# Altium schematic sheet PCB1.SchDoc
size A; SheetNumber: 1; SheetTotal: 1
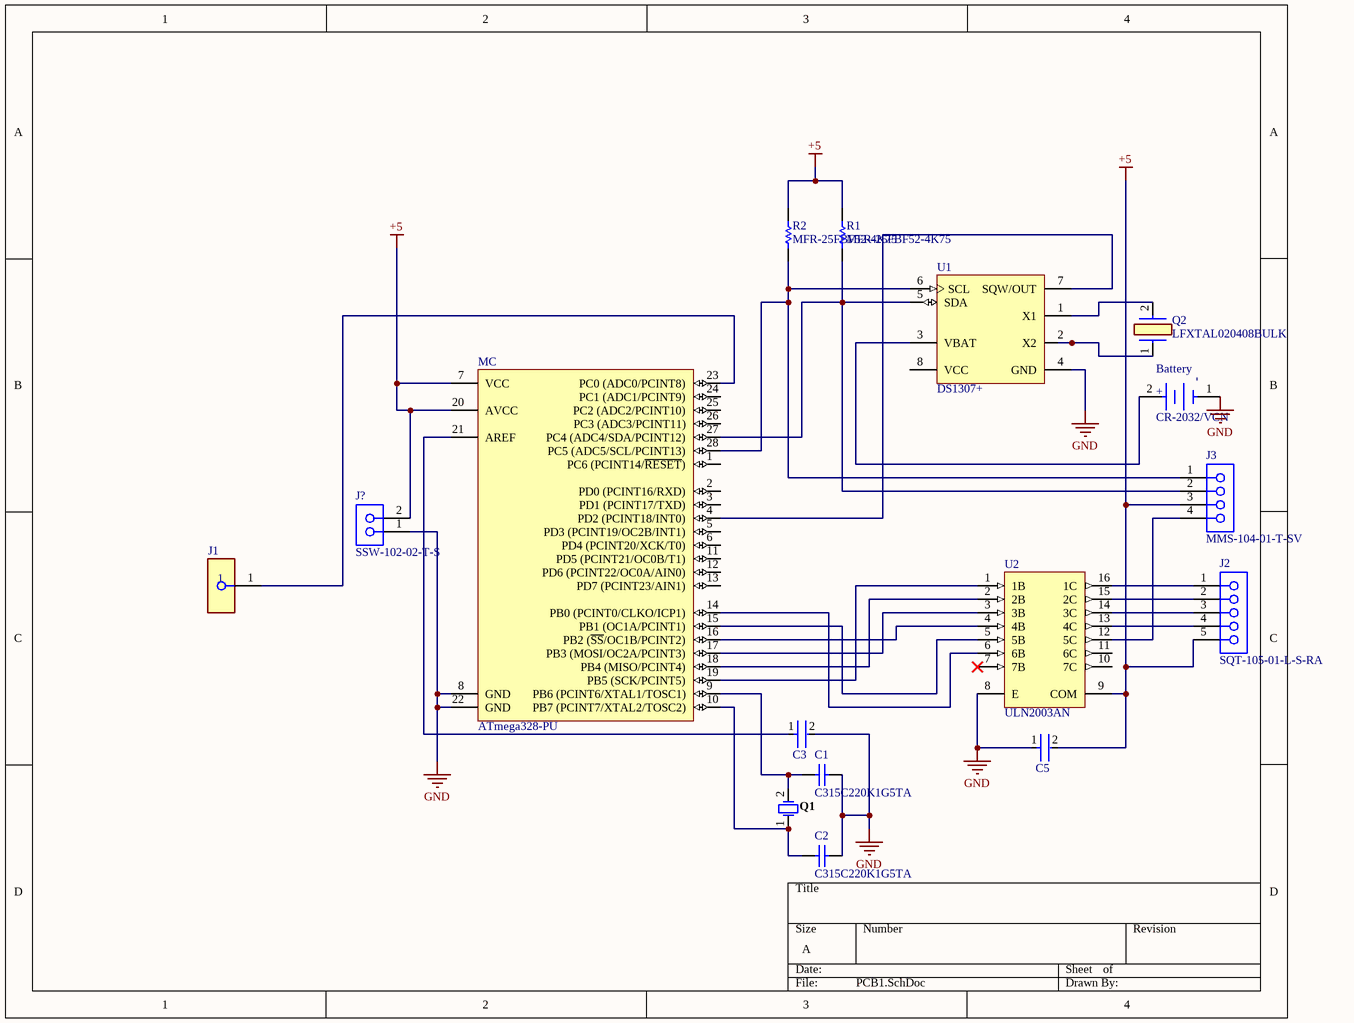
[diagram p0: PCB1.SchDoc]

## Parts
Battery  CR-2032/VCN  [FP-CR-2032-VCN-MFG]
C1  C315C220K1G5TA  [KEMT-C315-THT-2]
C2  C315C220K1G5TA  [KEMT-C315-THT-2]
C3  C322C104K5R5TA  [FP-C322C104K5R5TA-MFG]  (value not drawn)
C5  C322C104K5R5TA  [FP-C322C104K5R5TA-MFG]  (value not drawn)
J1  1801-0-15-15-30-27-04-0  [FP-1801-0-15-15-30-27-04-MFG]  (value not drawn)
J2  SQT-105-01-L-S-RA  [SMTC-SQT-105-01-X-S-RA]
J3  MMS-104-01-T-SV  [SMTC-MMS-104-01-X-SV]
J?  SSW-102-02-T-S  [SMTC-SSW-102-02-X-S]
MC  ATmega328-PU  [28P3]
Q1  FOXSLF/160-20  [FOX-FOXSLF160-20]  (value not drawn)
Q2  LFXTAL020408BULK  [LFXTAL020408BULK]
R1  MFR-25FBF52-4K75  [RESA60-630X240]
R2  MFR-25FBF52-4K75  [RESA60-630X240]
U1  DS1307+  [P8+2]
U2  ULN2003AN  [N0016A]

## Nets
+5: C5.2 J2.5 J3.3 J?.2 MC.7(VCC) MC.20(AVCC) R1.2 R2.2 U2.9(COM)
GND: Battery.1(C) C1.2 C2.2 C3.2 C5.1 J?.1 MC.8(GND) MC.22(GND) U1.4(GND) U2.8(E)
NetBattery_2: Battery.2(A) U1.3(VBAT)
NetC1_1: C1.1 MC.9(PB6_(PCINT6/XTAL1/TOSC1)) Q1.2
NetC2_1: C2.1 MC.10(PB7_(PCINT7/XTAL2/TOSC2)) Q1.1
NetC3_1: C3.1 MC.21(AREF)
NetJ1_1: J1.1 MC.23(PC0_(ADC0/PCINT8))
NetJ2_1: J2.1 U2.16(1C)
NetJ2_2: J2.2 U2.15(2C)
NetJ2_3: J2.3 U2.14(3C)
NetJ2_4: J2.4 U2.13(4C)
NetJ3_1: J3.1 MC.28(PC5_(ADC5/SCL/PCINT13)) R2.1 U1.6(SCL)
NetJ3_2: J3.2 MC.27(PC4_(ADC4/SDA/PCINT12)) R1.1 U1.5(SDA)
NetJ3_4: J3.4 U2.12(5C)
NetMC_4: MC.4(PD2_(PCINT18/INT0)) U1.7(SQW/OUT)
NetMC_14: MC.14(PB0_(PCINT0/CLKO/ICP1)) U2.6(6B)
NetMC_15: MC.15(PB1_(OC1A/PCINT1)) U2.5(5B)
NetMC_16: MC.16(PB2_(~{SS}/OC1B/PCINT2)) U2.4(4B)
NetMC_17: MC.17(PB3_(MOSI/OC2A/PCINT3)) U2.3(3B)
NetMC_18: MC.18(PB4_(MISO/PCINT4)) U2.2(2B)
NetMC_19: MC.19(PB5_(SCK/PCINT5)) U2.1(1B)
NetQ2_1: Q2.1 U1.2(X2)
NetQ2_2: Q2.2 U1.1(X1)

Not connected (* = marked no-connect by the designer): MC 1(PC6_(PCINT14/~{RESET})) 2(PD0_(PCINT16/RXD)) 3(PD1_(PCINT17/TXD)) 5(PD3_(PCINT19/OC2B/INT1)) 6(PD4_(PCINT20/XCK/T0)) 11(PD5_(PCINT21/OC0B/T1)) 12(PD6_(PCINT22/OC0A/AIN0)) 13(PD7_(PCINT23/AIN1)) 24(PC1_(ADC1/PCINT9)) 25(PC2_(ADC2/PCINT10)) 26(PC3_(ADC3/PCINT11)); U1 8(VCC); U2 7(7B)* 10(7C) 11(6C)

## Notes on the sheet
- (in symbol CMP-05417-000001-1) -; +

## Library data of the parts
Battery = CMP-05417-000001-1: BATTERY LITHIUM 3V COIN 20MM; Manufacturer: Panasonic; Standoff Height: 1mm; Device Class L3: unset; Octopart: https://octopart.com/cr-2032%2Fvcn-panasonic-19088802; Temperature: -30°C to +60°C; Temperature Range High: +60°C; Height: 22.3mm; ComponentLink2URL: https://media.digikey.com/pdf/Data%20Sheets/Panasonic%20Batteries%20PDFS/CR-2032_VCN_Dwg.PDF; Mouser Description: Coin Cell Battery 3V 225mAH; Category: Batt; Automotive: No; Device Class L1: Passive Components; Digikey Description: BATTERY LITHIUM 3V COIN 20MM; Device Class L2: unset; Manufacturer Part Number: CR-2032/VCN; ComponentLink2Description: Datasheet; Temperature Range Low: -30°C; Package: CR-2032/VCN
C1 C2 = CMP-1664-00008-1: Capacitor, Ceramic, 22 pF, +/-10 %, 100 V, -55 to 125 degC, 2-Pin THD, RoHS, Bulk; Max Input Voltage: 40 V; Min Input Voltage: 4.2 V; Output Current: 1.5 A; Output Voltage: 1.2 V; Outputs: 1; Case\Package: TO-220; RoHSCompliant: true; Min Operating Temperature: 0 degC; Max Operating Temperature: 125 degC; Package Quantity: 50; ComponentLink2URL: http://capacitoredge.kemet.com/capedge2/DataSheet/Datasheet-C315C220K1G5TA.pdf?pn=C315C220K1G5TA{BULK}; Radiation Hardening: No; Pins: 3; Length: 10.28 mm; ComponentLink1URL: http://www.kemet.com/; ComponentLink2Description: Datasheet; Height: 9.28 mm; REACH SVHC: No SVHC; ComponentLink1Description: Manufacturer URL; Max Ouput Current: 1.5 A; Weight: 0.08113 oz; Packaging: Rail/Tube; DatasheetVersion: Aug-16; Mount: Through Hole; PackageReference: C315-THT-2; Width: 4.82 mm; PackageDescription: 2-Pin Through Hole Device, Body 3.81 x 2.54 mm
C3 C5 = CMP-03020-034661-1: CAP CER 0.1UF 50V X7R RADIAL; Capacitance: 100nF; Dielectric Material: Ceramic; Dissipation Factor: 2.5%; Lead Length: 7mm; Tolerance: 10%; Lead Diameter: 0.51mm; Lead/Base Style: Formed Leads; Construction: RADIAL; RoHS Compliant: Yes; Voltage Rating (DC): 50V; Packaging: Bulk; Lead Free: Lead Free; Width: 0.125inch; Lead Pitch: 5.08mm; Voltage Rating: 50V; Number of Pins: 2; Radiation Hardening: No; Material: Ceramic; REACH SVHC: No SVHC; Height - Seated (Max): 0.26inch; Case/Package: Radial; Weight: 0.0625lb; Dielectric: X7R; Min Operating Temperature: -55°C; Voltage: 50V; Series: Golden Max™; Max Operating Temperature: 125°C; Height: 3.18mm; Termination: Radial; Length: 5.08mm; Depth: 3.18mm; Package Quantity: 500; Mount: Through Hole
J1 = CMP-07777-000001-1: CONN PIN RCPT .015-.025 PRESSFIT; Manufacturer: Mill-Max; Conn Orientation: Straight; Number Of Contacts: 1; Is Female: yes; Current Rating: 3A; Device Class L2: unset; Automotive: No; Temperature Range High: +125°C; Lead Free: Yes; Mouser Description: Circuit Board Hardware - PCB 10u AU OVER NI 30 CON; ComponentLink2URL: https://www.mill-max.com/products/datasheet/recpin/1801-0-15-15-30-27-04-0; Octopart: https://octopart.com/1801-0-15-15-30-27-04-0-mill-max-1175098; Device Class L1: Connectors; Manufacturer Part Number: 1801-0-15-15-30-27-04-0; Temperature Range Low: -55°C; Digikey Description: CONN PIN RCPT .015-.025 PRESSFIT; Package: 1801-0-15-15-30-27-04-0; ComponentLink2Description: Datasheet; Device Class L3: unset; RoHS: TRUE; Contact Material: Gold,Nickel; Category: Conn; Temperature: -55°C to +125°C; Height: 4.32mm
J2 = CMP-1021-00083-1: Cost-Effective Rugged Socket, Through-hole, Right Angle, -55 to 125 degC, 2 mm Pitch, 5-Pin, Female, RoHS; Manufacturer: Samtec; Pitch: 2 mm; ComponentLink3Description: Package Specification; PackageVersion: BY, 7/1995; PackageReference: SQT-105-01-X-S-RA; ComponentLink1URL: http://www.samtec.com; DatasheetVersion: F-214; Mounting Technology: Through-hole; PartNumber: SQT-105-01-L-S-RA; Temperature Range: -55 to 125 degC; Orientation: Right Angle; ComponentLink2Description: Datasheet; ComponentLink3URL: http://www.samtec.com/documents/webfiles/cpdf/SQT-1XX-XX-XXX-X-XXX-XXX-MKT.pdf; RoHS: True; ComponentLink1Description: Manufacturer URL; PackageDescription: 2mm Socket Strip Assembly; ComponentLink2URL: http://www.samtec.com/documents/webfiles/pdf/SQT_TH.PDF
J3 = CMP-1022-00068-1: Tiger Claw(TM) Socket Strip, Through-hole, Vertical, -55 to 105 degC, 2 mm Pitch, 4-Pin, Female, RoHS; Manufacturer: Samtec; Pitch: 2 mm; PackageDescription: 2mm Through Hole Box Connector Strip Assembly; DatasheetVersion: F-214; ComponentLink1URL: http://www.samtec.com; RoHS: True; Temperature Range: -55 to 105 degC; ComponentLink1Description: Manufacturer URL; PartNumber: MMS-104-01-T-SV; Mounting Technology: Through-hole; ComponentLink2Description: Datasheet; Orientation: Vertical; ComponentLink2URL: http://www.samtec.com/documents/webfiles/pdf/MMS.PDF; ComponentLink3Description: Package Specification; ComponentLink3URL: http://www.samtec.com/documents/webfiles/cpdf/MMS-1XX-01-XXX-XX-XXX-MKT1.pdf; PackageVersion: AO, 2/1993; PackageReference: MMS-104-01-X-SV
J? = CMP-1023-00323-1: SQ Post Socket, Through-hole, Vertical, -55 to 105 degC, 2.54 mm Pitch, 2-Pin, Female, RoHS; Manufacturer: Samtec; Pitch: 2.54 mm; ComponentLink3Description: Package Specification; ComponentLink2Description: Datasheet; ComponentLink1Description: Manufacturer URL; PackageVersion: CA, 6/1987; DatasheetVersion: F-214; PackageDescription: Assembly, Socket Strip .016 X .031 Tail; ComponentLink2URL: http://www.samtec.com/documents/webfiles/pdf/SSW_TH.PDF; RoHS: True; ComponentLink3URL: http://www.samtec.com/documents/webfiles/cpdf/SSW-1XX-XX-XXX-X-XX-XXX-XX-MKT.pdf; ComponentLink1URL: http://www.samtec.com; PackageReference: SSW-102-02-X-S; Mounting Technology: Through-hole; Orientation: Vertical; Temperature Range: -55 to 105 degC; PartNumber: SSW-102-02-T-S
MC = CMP-0095-00015-2: 8-bit AVR Microcontroller, 32KB Flash, 1KB EEPROM, 2KB SRAM, 28-pin PDIP, Industrial Grade (-40°C to 85°C); ComponentLink3Description: ATmega48A/48PA/88A/88PA/168A/168PA/328/328P Summary; RevisionNote: DatasheetVersion updated. URLs added.; DatasheetVersion: revD, May-2011; ComponentLink1URL: http://www.atmel.com/; PackageVersion: revB, Sep-2001; PackageDescription: 28-lead (0.300"/7.62mm Wide) Plastic Dual Inline Package (PDIP); PackageReference: 28P3; ComponentLink1Description: Manufacturer URL; ComponentLink2Description: ATmega48A/48PA/88A/88PA/168A/168PA/328/328P Datasheet; ComponentLink3URL: http://www.atmel.com/dyn/resources/prod_documents/8271S.pdf; ComponentLink2URL: http://www.atmel.com/dyn/resources/prod_documents/8271.pdf
Q1 = CMP-1749-00003-1: Resistance Weld Thru-Hole Crystal, 16 MHz, -20 to 70 degC, 2-Pin THD, RoHS, Bulk; Voltage Rating: 250 V; Tolerance: 1%; Resistance: 221 kohm; Case\Package: Axial; Power Rating: 250 mW; RoHSCompliant: true; Package Quantity: 200; Packaging: Bulk; Min Operating Temperature: -55 degC; DatasheetVersion: Mar-15; ComponentLink1URL: http://www.foxonline.com/; Max Operating Temperature: 155 degC; PackageReference: FOXSLF160-20; Mount: Through Hole; PackageDescription: 2-Pin Through Hole Device, Body 11.35 x 4.65 mm; ComponentLink1Description: Manufacturer URL; ComponentLink2URL: http://www.foxonline.com/pdfs/hc49slf.pdf; ComponentLink2Description: Datasheet; Length: 0.248 inch
Q2 = LFXTAL020408BULK: Crystal or Oscillator; Manufacturer_Name: IQD; Datasheet Link: https://hu.mouser.com/datasheet/2/741/LFXTAL020408Bulk-993044.pdf; Height: 13.46mm; Manufacturer_Part_Number: LFXTAL020408BULK; Mouser Part Number: 449-LFXTAL020408BULK; Mouser Price/Stock: https://www.mouser.co.uk/ProductDetail/IQD/LFXTAL020408Bulk?qs=e4%2FAndAAwgLuMnAnupy0Ng%3D%3D
R1 R2 = CMP-1659-00066-1: Axial Resistor, 4.75 KOhm, +/- 1%, 0.25 W, -55 to 155 degC, 2-Pin THD, RoHS, Bulk; Case\Package: 1210; Voltage Rating (DC): 25 V; Type (Capacitors): X7R; Capacitance: 22 uF; Tolerance: 10%; PackageReference: MFR-25; DatasheetVersion: Apr-13; PackageDescription: 2-Pin Axial Lead, Dia 2.4 mm, Body Length 6.3 mm; ComponentLink1URL: http://www.yageo.com/; Radiation Hardening: No; Mount: Surface Mount; Height: 2.5 mm; Pins: 2; Package Quantity: 1000; REACH SVHC: No SVHC; Case Code (Imperial): 1210; Packaging: Tape and Reel; Max Operating Temperature: 125 degC; Case Code (Metric): 3225; ComponentLink1Description: Manufacturer URL; Min Operating Temperature: -55 degC; ComponentLink2Description: Datasheet; Voltage Rating: 25 V; Length: 3.2 mm; ComponentLink2URL: http://www.yageo.com/documents/recent/Yageo%20LR_MFR_2013.pdf; RoHSCompliant: true; Width: 2.5 mm
U1 = CMP-0254-00152-1: 64 x 8, Serial, I2C Real-Time Clock, 5.0V, 8-Pin PDIP, 0 to 70 degC, Pb-Free; ComponentLink2URL: http://datasheets.maxim-ic.com/en/ds/DS1307.pdf; ComponentLink3URL: http://pdfserv.maxim-ic.com/package_dwgs/21-0043.PDF; ComponentLink1Description: Manufacturer URL; PackageVersion: revE, 2011; ComponentLink1URL: http://www.maxim-ic.com; PackageDescription: 8-Pin Plastic Dual-In-Line, Narrow (0.3in), Pitch 2.54 mm, PDIP(N), Pb-Free; ComponentLink2Description: Datasheet; Code_JEDEC: MS-001-AB; PackageReference: P8+2; DatasheetVersion: 10-Feb-2008; ComponentLink3Description: Package Specification
U2 = CMP-2000-07352-1: High-Voltage, High-Current Darlington Transistor Array, 50 V, 500 mA, -20 to 70 degC, 16-Pin PDIP (N), Pb-Free (RoHS), Tube; Manufacturer: TexasInstruments; Maximum Collector Emitter Saturation Voltage: 1.1@100mA; Peak DC Collector Current: 0.5A; Package Version: 4040049/E, 12/2002; Configuration: Array7; Maximum Collector Emitter Voltage: 50V; Rad Hard: No; Mounting: ThroughHole; Datasheet URL: http://www.ti.com/general/docs/lit/getliterature.tsp?genericPartNumber=uln2003a&fileType=pdf; Package: 16PDIP; Package Reference: N16; Datasheet Version: Rev. O, 01/2016; Mounting Technology: ThroughHole; Package Description: 16-Pin Plastic In-Line, Body 19.305 x 6.35 mm, Pitch 2.54 mm; Manufacturer URL: http://www.ti.com/; Type: NPN; Category: DarlingtonBJT; Package URL: http://www.ti.com/litv/pdf/mpdi002c; Packaging: Rail/Tube